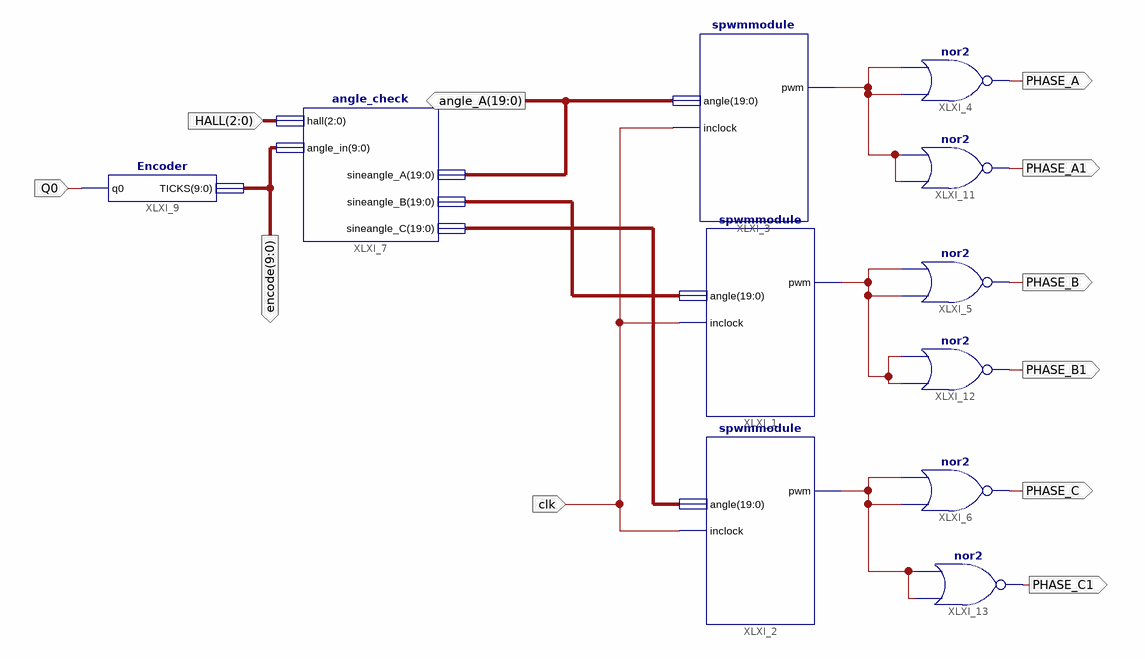
[diagram p0: schematic sheet 1]
// Xilinx ISE schematic Control_block.sch (spartan6) as structural Verilog: 11 symbols, 11 ports
module Control_block (
  input  Q0,
  input  clk,
  input  [2:0] HALL,
  output PHASE_A,
  output PHASE_B,
  output [9:0] encode,
  output [19:0] angle_A,
  output PHASE_C,
  output PHASE_A1,
  output PHASE_B1,
  output PHASE_C1
);

  wire XLXN_14, XLXN_16, XLXN_18;
  wire [19:0] XLXN_68, XLXN_69;

  spwmmodule XLXI_1 (.inclock(clk), .angle(XLXN_68), .pwm(XLXN_16));
  spwmmodule XLXI_2 (.inclock(clk), .angle(XLXN_69), .pwm(XLXN_18));
  spwmmodule XLXI_3 (.inclock(clk), .angle(angle_A), .pwm(XLXN_14));
  nor XLXI_4 (PHASE_A, XLXN_14, XLXN_14);
  nor XLXI_5 (PHASE_B, XLXN_16, XLXN_16);
  angle_check XLXI_7 (
    .hall(HALL), .angle_in(encode), .sineangle_A(angle_A), .sineangle_B(XLXN_68), .sineangle_C(XLXN_69));
  Encoder XLXI_9 (.q0(Q0), .TICKS(encode));
  nor XLXI_6 (PHASE_C, XLXN_18, XLXN_18);
  nor XLXI_11 (PHASE_A1, XLXN_14, XLXN_14);
  nor XLXI_12 (PHASE_B1, XLXN_16, XLXN_16);
  nor XLXI_13 (PHASE_C1, XLXN_18, XLXN_18);
endmodule
